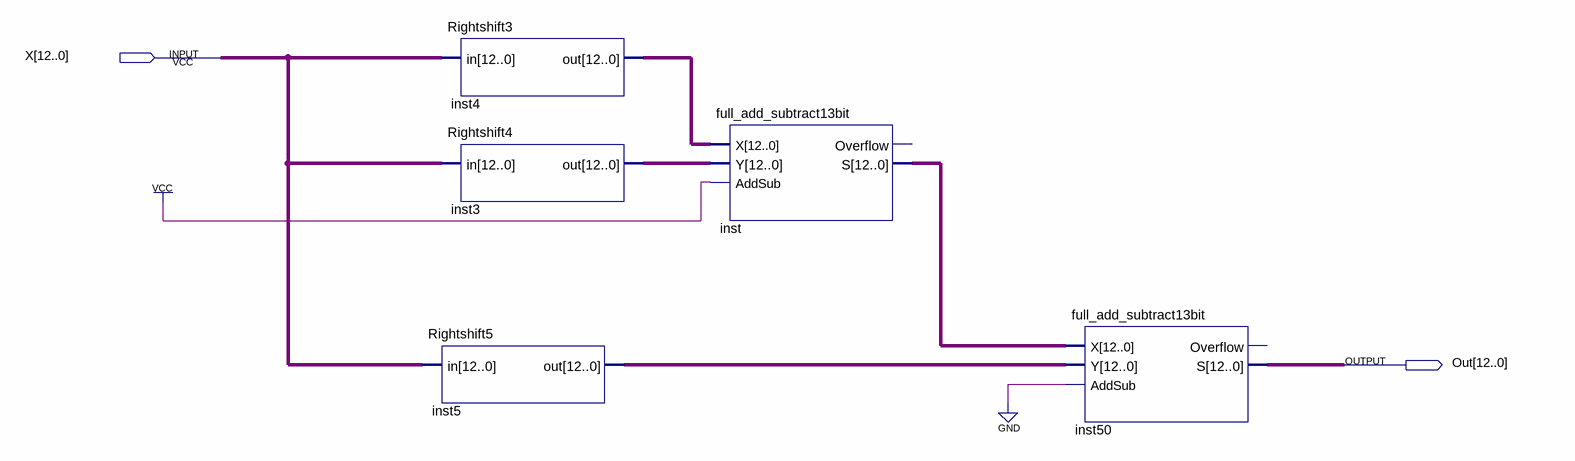
[diagram p0: schematic sheet]
// Quartus schematic Shiftdevideby10.bdf as structural Verilog: 5 symbols, 2 pins
module Shiftdevideby10 (
  input  [12:0] X,
  output [12:0] Out
);

  wire [12:0] inst3_out, inst4_out, inst5_out, inst_s;

  Rightshift3 inst4 (.in(X), .out(inst4_out));
  Rightshift4 inst3 (.in(X), .out(inst3_out));
  Rightshift5 inst5 (.in(X), .out(inst5_out));
  full_add_subtract13bit inst (.X(inst4_out), .Y(inst3_out), .AddSub(1'b1), .S(inst_s));  // open: Overflow
  full_add_subtract13bit inst50 (.X(inst_s), .Y(inst5_out), .AddSub(1'b0), .S(Out));  // open: Overflow
endmodule
